# EAGLE schematic FunctionGenerator (EAGLE 9.3.2)
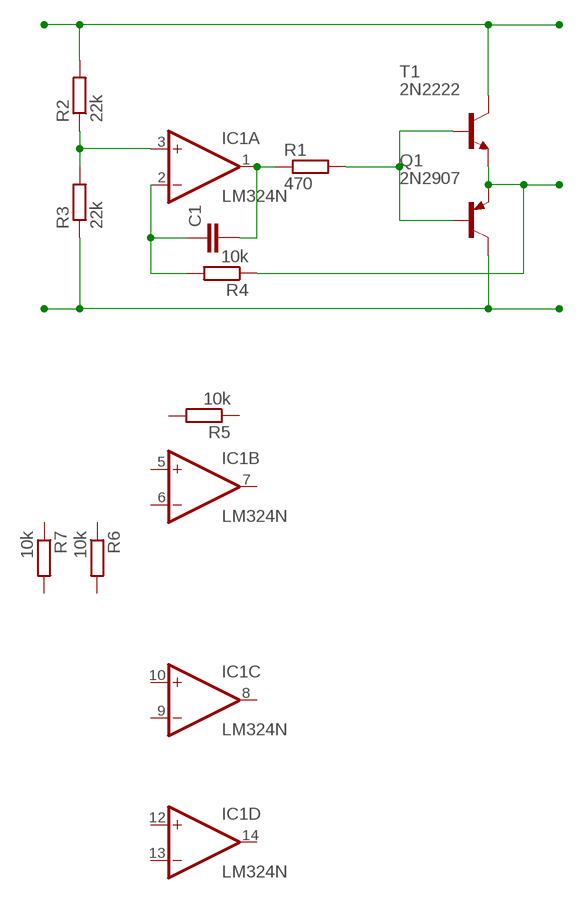
[diagram p0: schematic, sheet 1]

## Parts
C1  C-EU050-025X075  [C050-025X075]
IC1  LM324N  [DIL14]
Q1  2N2907  [TO18]
R1  470  R-EU_0207/10  [0207/10]
R2  22k  R-EU_0207/10  [0207/10]
R3  22k  R-EU_0207/10  [0207/10]
R4  10k  R-EU_0207/10  [0207/10]
R5  10k  R-EU_0207/10  [0207/10]
R6  10k  R-EU_0207/10  [0207/10]
R7  10k  R-EU_0207/10  [0207/10]
T1  2N2222  [TO18]

## Nets
N$1: Q1.2(B) R1.2 T1.2(B)
N$2: C1.2 IC1.1(A:OUT) R1.1
N$3: IC1.3(A:+IN) R2.1 R3.2
N$4: Q1.1(E) R4.1 T1.1(E)
N$5: C1.1 IC1.2(A:-IN) R4.2
V+: R2.2 T1.3(C)
V-: Q1.3(C) R3.1
Unconnected: IC1.5(B:+IN) IC1.6(B:-IN) IC1.7(B:OUT) IC1.8(C:OUT) IC1.9(C:-IN) IC1.10(C:+IN) IC1.12(D:+IN) IC1.13(D:-IN) IC1.14(D:OUT) R5.1 R5.2 R6.1 R6.2 R7.1 R7.2

## Power pins joined to a net without a drawn wire
V+: IC1.4(P:V+)
V-: IC1.11(P:V-)

## Library data of the parts
C1 = rcl:C-EU: CAPACITOR, European symbol; SPICEPREFIX: C
IC1 = linear:LM324: OP AMP
Q1 = transistor-pnp:2N2907*: PNP Transistor
R1-R7 = rcl:R-EU_: RESISTOR, European symbol; SPICEPREFIX: R
T1 = transistor:2N2222: NPN TRANSISTOR